# Altium schematic sheet Display_SACA.SchDoc
size A3; Organization: Altium Limited; Address1: L3, 12a Rodborough Rd; Address2: Frenchs Forest; Address3: NSW; Address4: Australia 2086
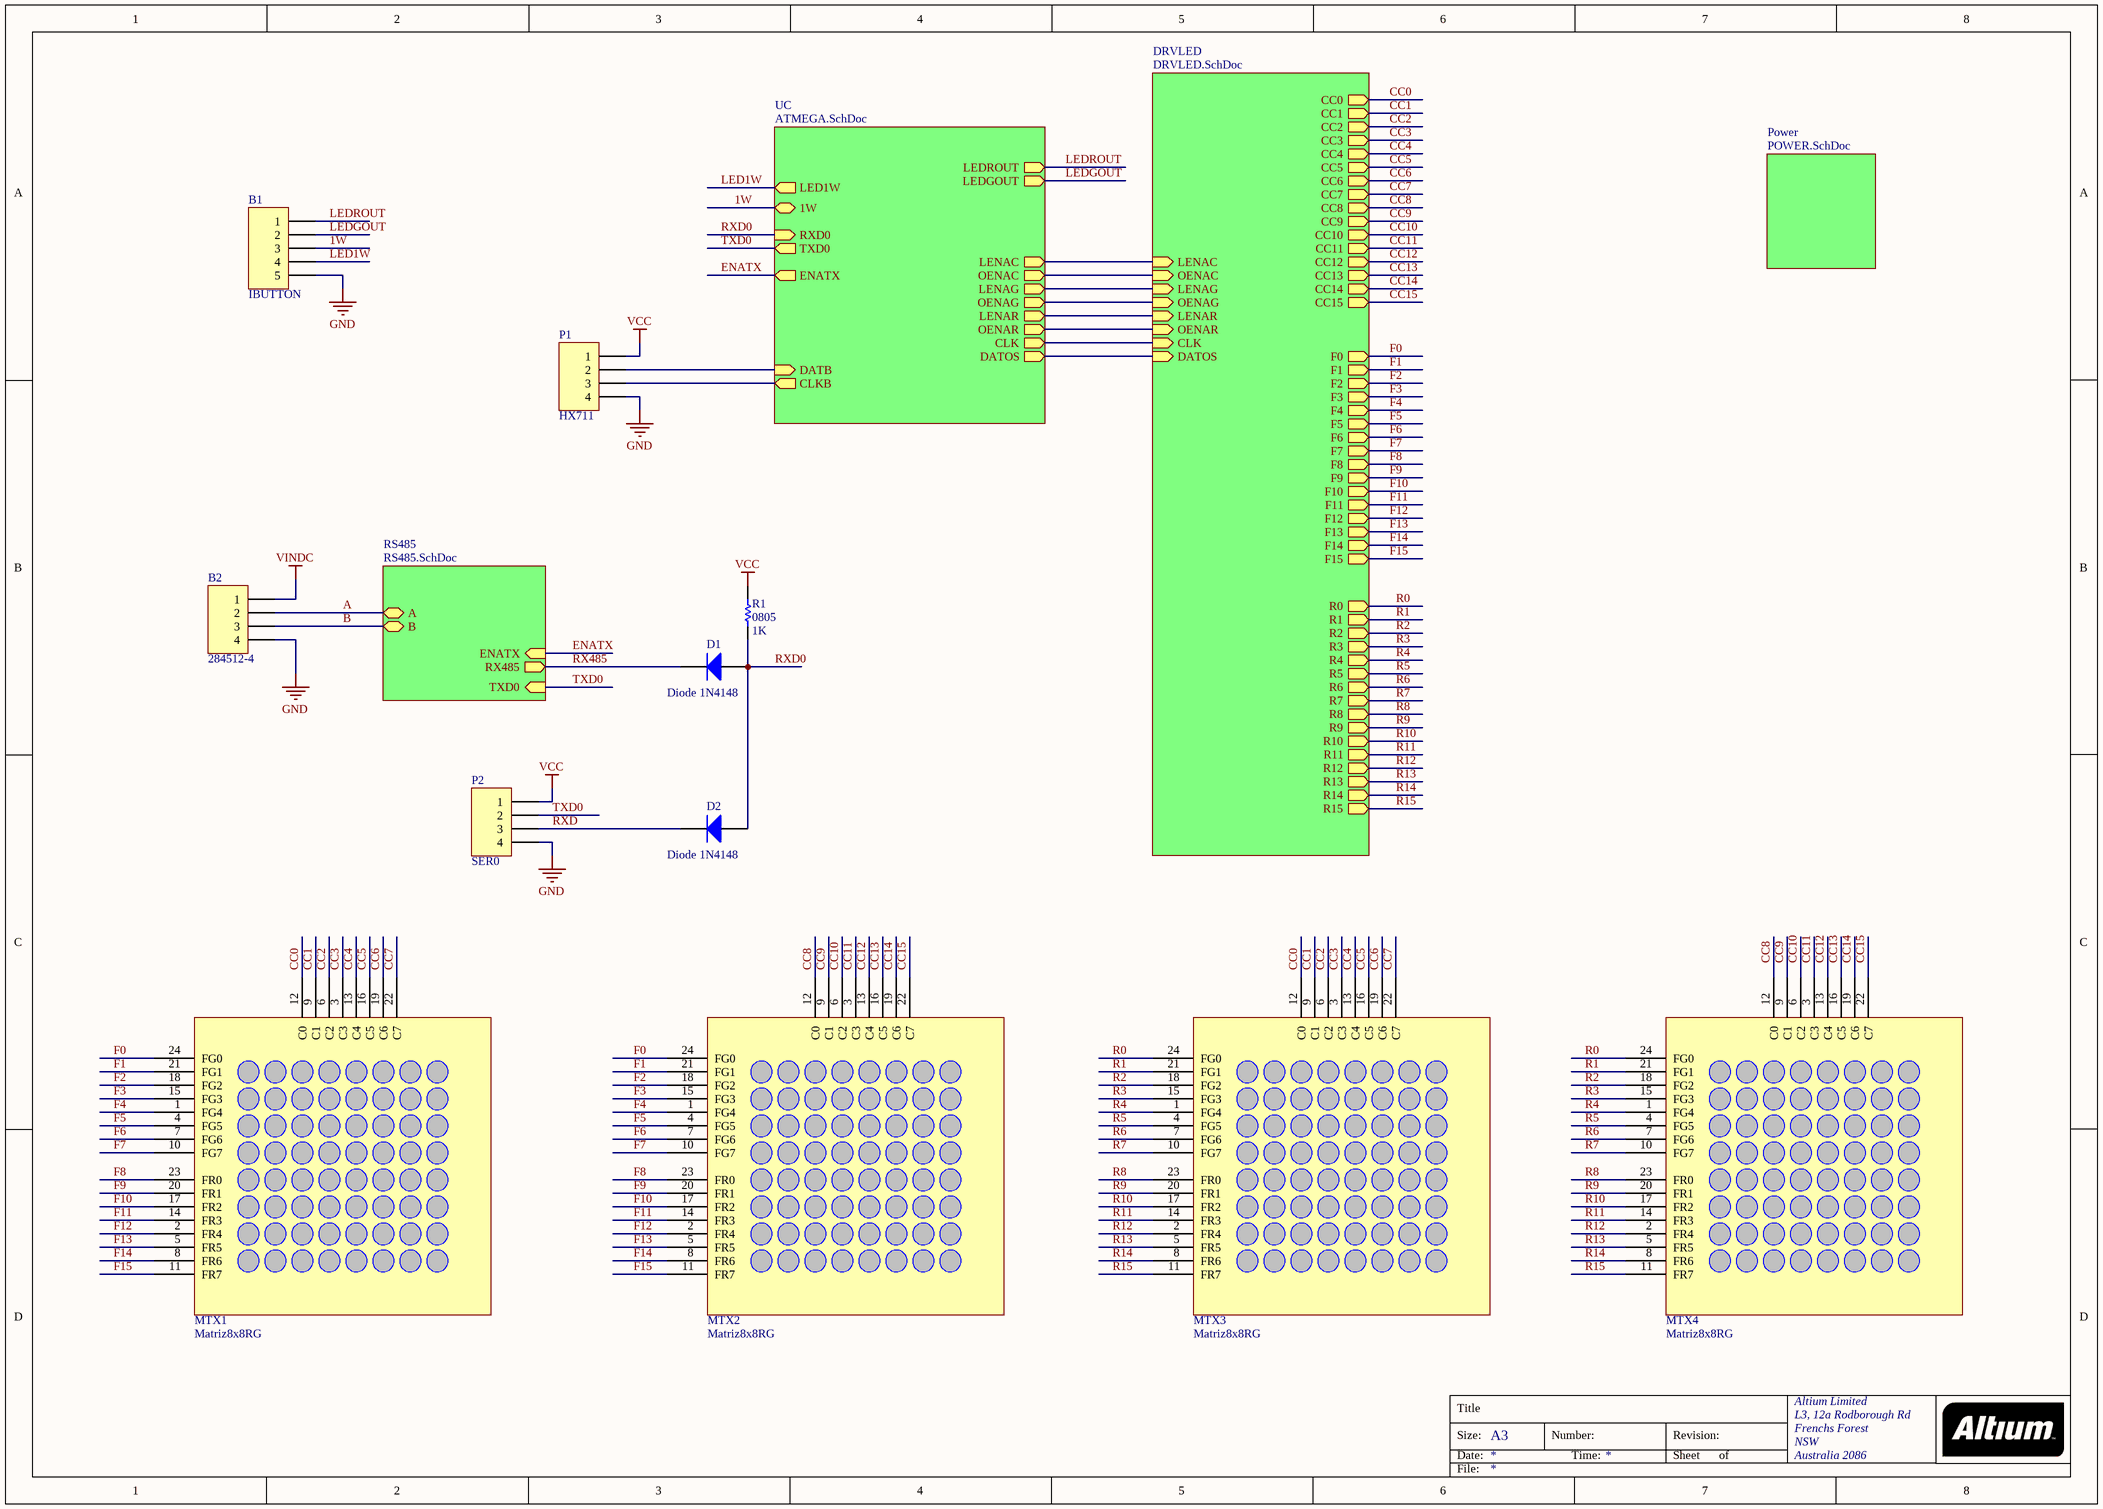
[diagram p0: Display_SACA.SchDoc]

## Parts
B1  IBUTTON  [BORNERA5-3.5]
B2  284512-4  [BORNERA4-3.5]
D1  Diode 1N4148  [1N4148SMD]
D2  Diode 1N4148  [1N4148SMD]
MTX1  Matriz8x8RG  [MatrizFuturlec]
MTX2  Matriz8x8RG  [MatrizFuturlec]
MTX3  Matriz8x8RG  [MatrizFuturlec]
MTX4  Matriz8x8RG  [MatrizFuturlec]
P1  HX711  [HDR1X4]
P2  SER0  [HDR1X4]
R1  0805  value 1K  [R0805]

## Sub-sheets
DRVLED = DRVLED.SchDoc: LENAC (in), OENAC (in), LENAG (in), OENAG (in), LENAR (in), OENAR (in), CLK (in), DATOS (in), CC0 (out), CC1 (out), CC2 (out), CC3 (out), CC4 (out), CC5 (out), CC6 (out), CC7 (out), F0 (out), F1 (out), F2 (out), F3 (out), F4 (out), F5 (out), F6 (out), F7 (out), F8 (out), F9 (out), F10 (out), F11 (out), F12 (out), F13 (out), F14 (out), F15 (out), R0 (out), R1 (out), R2 (out), R3 (out), R4 (out), R5 (out), R6 (out), R7 (out), R8 (out), R9 (out), R10 (out), R11 (out), R12 (out), R13 (out), R14 (out), R15 (out), CC8 (out), CC9 (out), CC10 (out), CC11 (out), CC12 (out), CC13 (out), CC14 (out), CC15 (out)
Power = POWER.SchDoc: no entries
RS485 = RS485.SchDoc: TXD0 (in), RX485 (out), A (bidir), B (bidir), ENATX (in)
UC = ATMEGA.SchDoc: 1W (bidir), RXD0 (in), TXD0 (out), ENATX (out), LEDGOUT (out), LEDROUT (out), LENAC (out), OENAC (out), LENAG (out), OENAG (out), LENAR (out), OENAR (out), CLK (out), DATOS (out), DATB (in), CLKB (out), LED1W (out)

## Nets
GND: B1.5 B2.4 P1.4 P2.4
VCC: P1.1 P2.1 R1.2
VINDC: B2.1
1W: B1.3 ; sheet UC/1W
A: B2.2 ; sheet RS485/A
B: B2.3 ; sheet RS485/B
CC0: MTX1.12(C0) MTX3.12(C0) ; sheet DRVLED/CC0
CC1: MTX1.9(C1) MTX3.9(C1) ; sheet DRVLED/CC1
CC2: MTX1.6(C2) MTX3.6(C2) ; sheet DRVLED/CC2
CC3: MTX1.3(C3) MTX3.3(C3) ; sheet DRVLED/CC3
CC4: MTX1.13(C4) MTX3.13(C4) ; sheet DRVLED/CC4
CC5: MTX1.16(C5) MTX3.16(C5) ; sheet DRVLED/CC5
CC6: MTX1.19(C6) MTX3.19(C6) ; sheet DRVLED/CC6
CC7: MTX1.22(C7) MTX3.22(C7) ; sheet DRVLED/CC7
CC8: MTX2.12(C0) MTX4.12(C0) ; sheet DRVLED/CC8
CC9: MTX2.9(C1) MTX4.9(C1) ; sheet DRVLED/CC9
CC10: MTX2.6(C2) MTX4.6(C2) ; sheet DRVLED/CC10
CC11: MTX2.3(C3) MTX4.3(C3) ; sheet DRVLED/CC11
CC12: MTX2.13(C4) MTX4.13(C4) ; sheet DRVLED/CC12
CC13: MTX2.16(C5) MTX4.16(C5) ; sheet DRVLED/CC13
CC14: MTX2.19(C6) MTX4.19(C6) ; sheet DRVLED/CC14
CC15: MTX2.22(C7) MTX4.22(C7) ; sheet DRVLED/CC15
ENATX: sheet RS485/ENATX, sheet UC/ENATX
F0: MTX1.24(FG0) MTX2.24(FG0) ; sheet DRVLED/F0
F1: MTX1.21(FG1) MTX2.21(FG1) ; sheet DRVLED/F1
F2: MTX1.18(FG2) MTX2.18(FG2) ; sheet DRVLED/F2
F3: MTX1.15(FG3) MTX2.15(FG3) ; sheet DRVLED/F3
F4: MTX1.1(FG4) MTX2.1(FG4) ; sheet DRVLED/F4
F5: MTX1.4(FG5) MTX2.4(FG5) ; sheet DRVLED/F5
F6: MTX1.7(FG6) MTX2.7(FG6) ; sheet DRVLED/F6
F7: MTX1.10(FG7) MTX2.10(FG7) ; sheet DRVLED/F7
F8: MTX1.23(FR0) MTX2.23(FR0) ; sheet DRVLED/F8
F9: MTX1.20(FR1) MTX2.20(FR1) ; sheet DRVLED/F9
F10: MTX1.17(FR2) MTX2.17(FR2) ; sheet DRVLED/F10
F11: MTX1.14(FR3) MTX2.14(FR3) ; sheet DRVLED/F11
F12: MTX1.2(FR4) MTX2.2(FR4) ; sheet DRVLED/F12
F13: MTX1.5(FR5) MTX2.5(FR5) ; sheet DRVLED/F13
F14: MTX1.8(FR6) MTX2.8(FR6) ; sheet DRVLED/F14
F15: MTX1.11(FR7) MTX2.11(FR7) ; sheet DRVLED/F15
LED1W: B1.4 ; sheet UC/LED1W
LEDGOUT: B1.2 ; sheet UC/LEDGOUT
LEDROUT: B1.1 ; sheet UC/LEDROUT
R0: MTX3.24(FG0) MTX4.24(FG0) ; sheet DRVLED/R0
R1: MTX3.21(FG1) MTX4.21(FG1) ; sheet DRVLED/R1
R2: MTX3.18(FG2) MTX4.18(FG2) ; sheet DRVLED/R2
R3: MTX3.15(FG3) MTX4.15(FG3) ; sheet DRVLED/R3
R4: MTX3.1(FG4) MTX4.1(FG4) ; sheet DRVLED/R4
R5: MTX3.4(FG5) MTX4.4(FG5) ; sheet DRVLED/R5
R6: MTX3.7(FG6) MTX4.7(FG6) ; sheet DRVLED/R6
R7: MTX3.10(FG7) MTX4.10(FG7) ; sheet DRVLED/R7
R8: MTX3.23(FR0) MTX4.23(FR0) ; sheet DRVLED/R8
R9: MTX3.20(FR1) MTX4.20(FR1) ; sheet DRVLED/R9
R10: MTX3.17(FR2) MTX4.17(FR2) ; sheet DRVLED/R10
R11: MTX3.14(FR3) MTX4.14(FR3) ; sheet DRVLED/R11
R12: MTX3.2(FR4) MTX4.2(FR4) ; sheet DRVLED/R12
R13: MTX3.5(FR5) MTX4.5(FR5) ; sheet DRVLED/R13
R14: MTX3.8(FR6) MTX4.8(FR6) ; sheet DRVLED/R14
R15: MTX3.11(FR7) MTX4.11(FR7) ; sheet DRVLED/R15
RX485: D1.2(K) ; sheet RS485/RX485
RXD: D2.2(K) P2.3
RXD0: D1.1(A) D2.1(A) R1.1 ; sheet UC/RXD0
TXD0: P2.2 ; sheet RS485/TXD0, sheet UC/TXD0
NetP1_2: P1.2 ; sheet UC/DATB
NetP1_3: P1.3 ; sheet UC/CLKB
(unnamed): sheet UC/LENAC, sheet DRVLED/LENAC
(unnamed): sheet UC/OENAC, sheet DRVLED/OENAC
(unnamed): sheet UC/LENAG, sheet DRVLED/LENAG
(unnamed): sheet UC/OENAG, sheet DRVLED/OENAG
(unnamed): sheet UC/LENAR, sheet DRVLED/LENAR
(unnamed): sheet UC/OENAR, sheet DRVLED/OENAR
(unnamed): sheet UC/CLK, sheet DRVLED/CLK
(unnamed): sheet UC/DATOS, sheet DRVLED/DATOS

## Notes on the sheet
- Title
- Size:
- Date:
- A3
- Number:
- Time:
- Revision:
- Sheet
- of
- File:

## Library data of the parts
B1 = Bornera 5 3.5mm: Header, 5-Pin; Part: A98399-ND; Proveedor: Digikey; LatestRevisionDate: 17-Jul-2002; LatestRevisionNote: Re-released for DXP Platform.; Publisher: Altium Limited; Price: 0.20
B2 = BORNERA4-3.5: TERM BLOCK HEADER  4POS R/A 3.5MM; Part: A98398-ND; Proveedor: Digikey; LatestRevisionDate: 17-Jul-2002; LatestRevisionNote: Re-released for DXP Platform.; Publisher: Altium Limited; Price: 1.11
D1 D2 = Diode 1N4148: 1N4148; Part: 1N4148WTPMSCT; Proveedor: Digikey; Published: 8-Jun-2000; LatestRevisionDate: 17-Jul-2002; LatestRevisionNote: Re-released for DXP Platform.; PackageVersion: Sep-1996; PackageReference: SMC; Publisher: Altium Limited; Code_JEDEC: DO-214-AB; Price: 0.202
MTX1-MTX4 = Matriz8x8RG: MATRIZ8X8 RG Anodo Comun Columnas
P1 P2 = Header 4: Header, 4-Pin; LatestRevisionDate: 17-Jul-2002; LatestRevisionNote: Re-released for DXP Platform.; Publisher: Altium Limited
R1 = Res 0805 1K: Semiconductor Resistor; Part: 541-1.0KACT; Proveedor: Digikey; Published: 8-Jun-2000; LatestRevisionDate: 17-Jul-2002; LatestRevisionNote: Re-released for DXP Platform.; PackageReference: AXIAL-0.5; Publisher: Altium Limited; Price: 0.077